# Altium schematic sheet USBPD_CH211.SchDoc
size A3; SheetNumber: 1; SheetTotal: 1
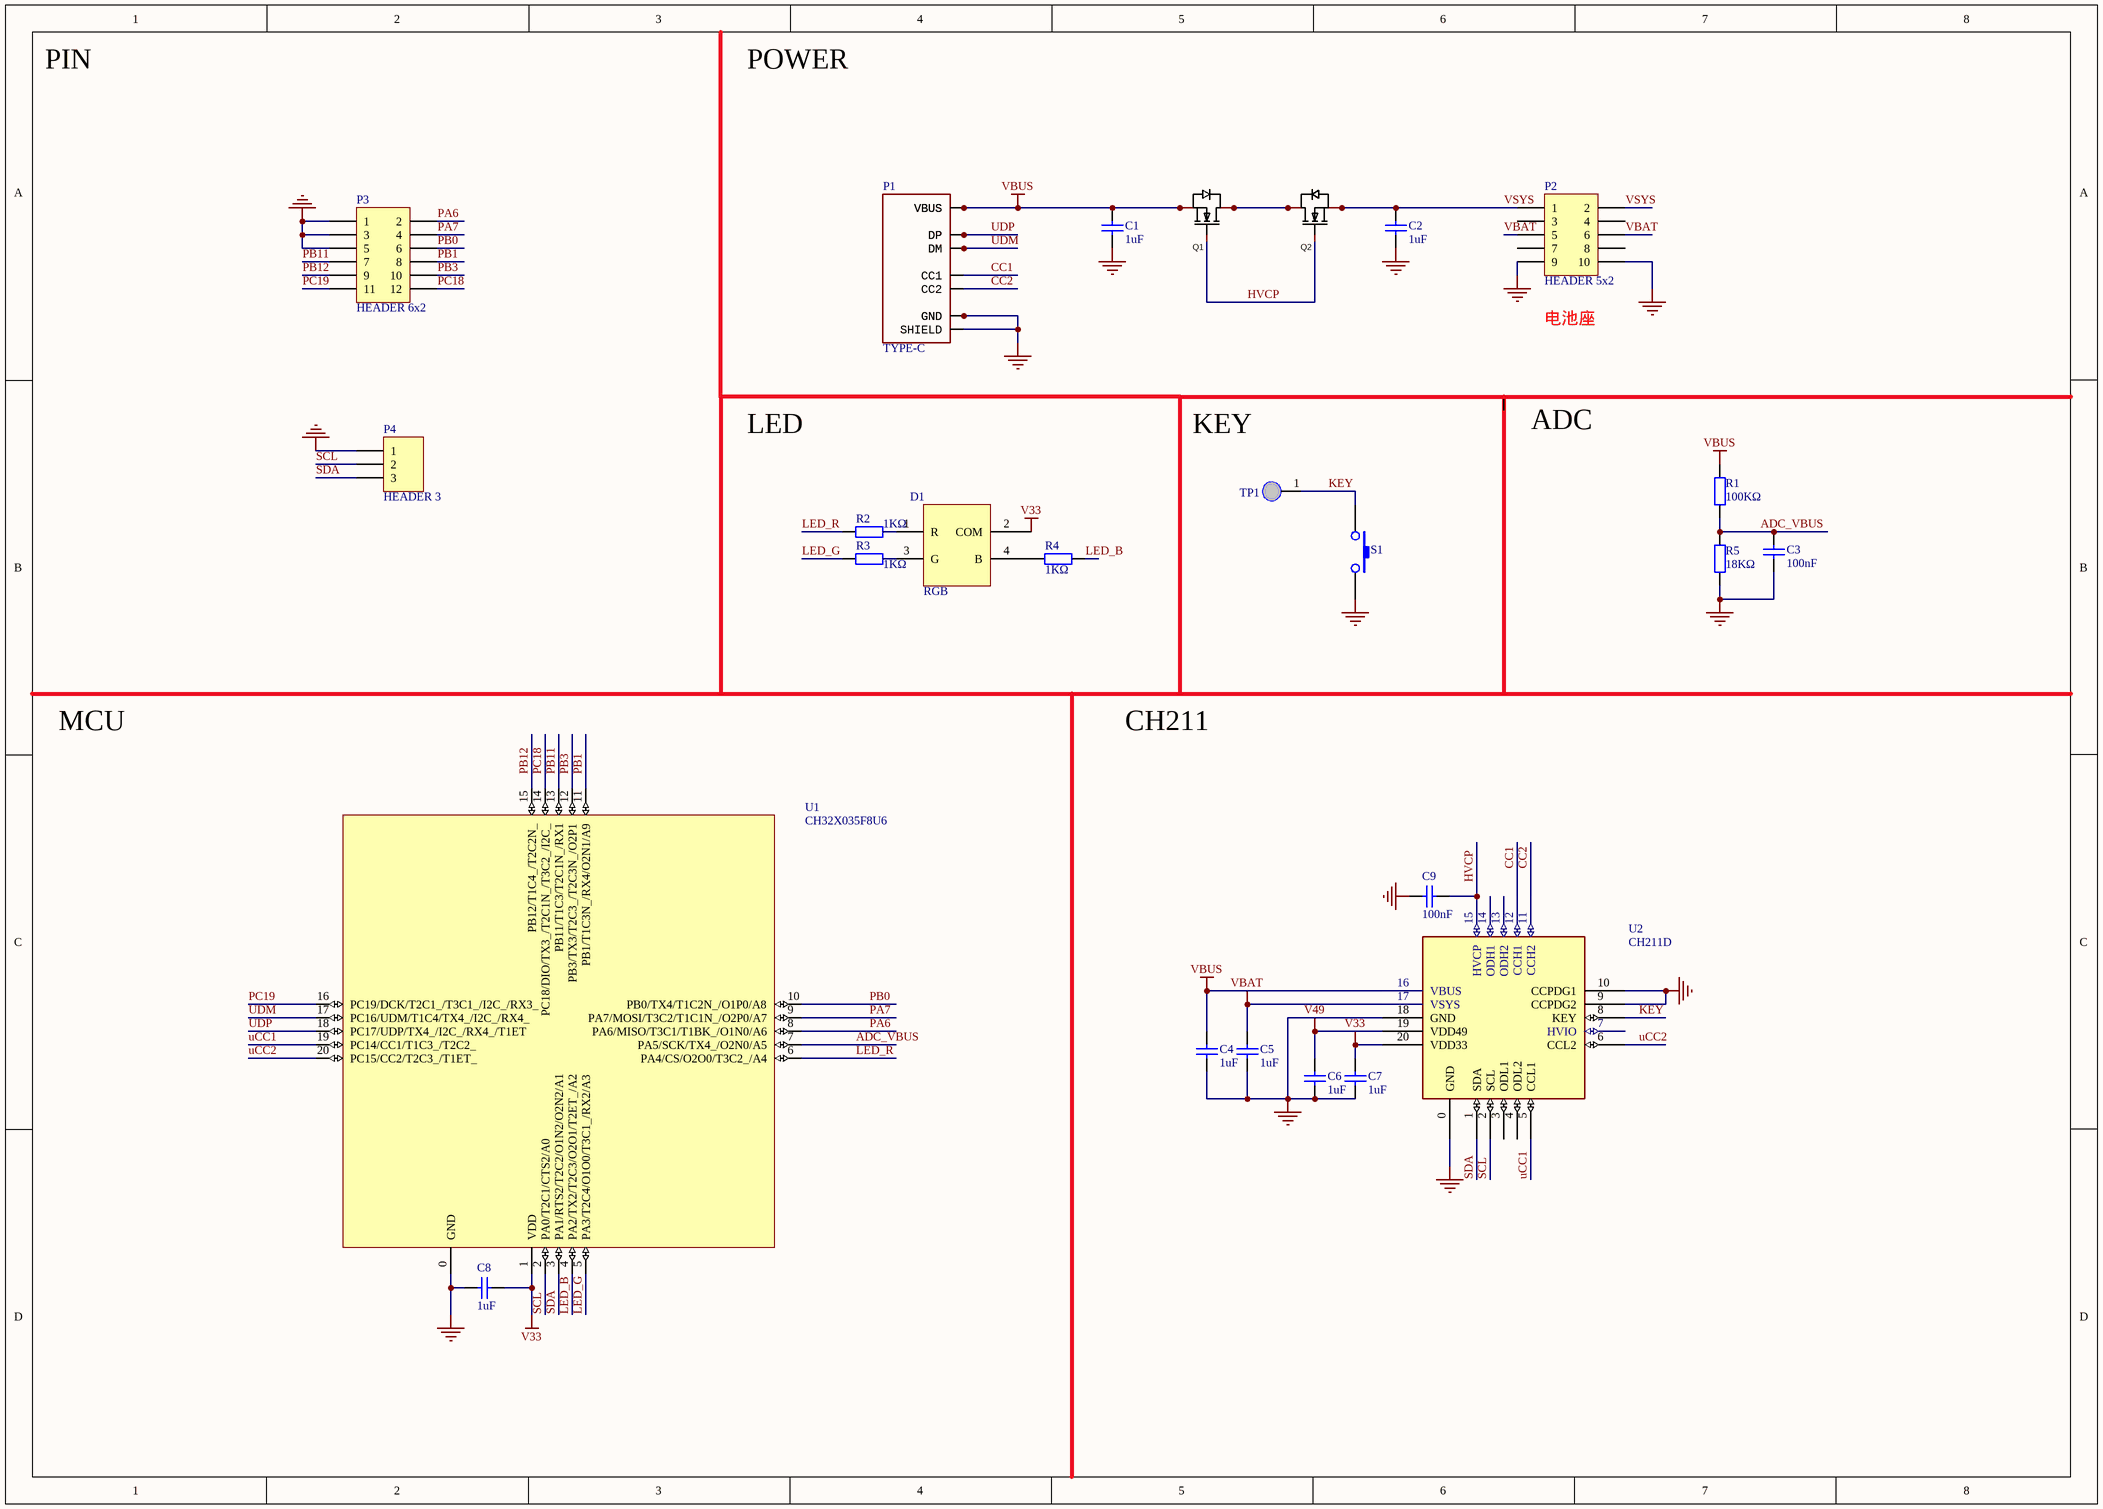
[diagram p0: USBPD_CH211.SchDoc]

## Parts
C1  1uF  [0603_C]
C2  1uF  [0603_C]
C3  100nF  [0603_C]
C4  1uF  [0603_C]
C5  1uF  [0603_C]
C6  1uF  [0603_C]
C7  1uF  [0603_C]
C8  1uF  [0603_C]
C9  100nF  [0603_C]
D1  RGB  [RGB 3030]
P1  TYPE-C  [TYPE-C-Receptacle-2.0]
P2  HEADER 5x2  [HDR2X5]
P3  HEADER 6x2  [HDR2X6]
P4  HEADER 3  [HDR1X3]
Q1  ASDM40N52E-R  [DFN-8_L3.1-W3.0-P0.65-LS3.3-BL]  (value not drawn)
Q2  ASDM40N52E-R  [DFN-8_L3.1-W3.0-P0.65-LS3.3-BL]  (value not drawn)
R1  100KΩ  [0603_R]
R2  1KΩ  [0603_R]
R3  1KΩ  [0603_R]
R4  1KΩ  [0603_R]
R5  18KΩ  [0603_R]
S1  KEY  [Button DTSZML-6]  (value not drawn)
TP1  Testpoint  [TESTPOINT3]  (value not drawn)
U1  CH32X035F8U6  [QFN20_3X3]
U2  CH211D  [QFN20_3X3]

## Nets
GND: C1.1 C2.1 C3.1 C4.1 C5.1 C6.1 C7.1 C8.2 C9.2 P1.0(SHIELD) P1.A1(GND) P1.A12(GND) P1.B1(GND) P1.B12(GND) P2.9 P2.10 P3.1 P3.3 P3.5 P4.1 R5.2 S1.2 U1.0(GND) U2.0(GND) U2.9(CCPDG2) U2.10(CCPDG1) U2.18(GND)
V33: C7.2 C8.1 D1.2(COM) U1.1(VDD) U2.20(VDD33)
V49: C6.2 U2.19(VDD49)
VBAT: C5.2 P2.5 P2.6 U2.17(VSYS)
VBUS: C1.2 C4.2 P1.A4(VBUS) P1.A9(VBUS) P1.B4(VBUS) P1.B9(VBUS) Q1.1(S) Q1.2(S) Q1.3(S) R1.1 U2.16(VBUS)
ADC_VBUS: C3.2 R1.2 R5.1 U1.7(PA5/SCK/TX4_/O2N0/A5)
CC1: P1.A5(CC1) U2.12(CCH1)
CC2: P1.B5(CC2) U2.11(CCH2)
HVCP: C9.1 Q1.4(G) Q2.4(G) U2.15(HVCP)
KEY: S1.3 TP1.1 U2.8(KEY)
LED_B: R4.2 U1.4(PA2/TX2/T2C3/O2O1/T2ET_/A2)
LED_G: R3.1 U1.5(PA3/T2C4/O1O0/T3C1_/RX2/A3)
LED_R: R2.1 U1.6(PA4/CS/O2O0/T3C2_/A4)
PA6: P3.2 U1.8(PA6/MISO/T3C1/T1BK_/O1N0/A6)
PA7: P3.4 U1.9(PA7/MOSI/T3C2/T1C1N_/O2P0/A7)
PB0: P3.6 U1.10(PB0/TX4/T1C2N_/O1P0/A8)
PB1: P3.8 U1.11(PB1/T1C3N_/RX4/O2N1/A9)
PB3: P3.10 U1.12(PB3/TX3/T2C3_/T2C3N_/O2P1)
PB11: P3.7 U1.13(PB11/T1C3/T2C1N_/RX1)
PB12: P3.9 U1.15(PB12/T1C4_/T2C2N_)
PC18: P3.12 U1.14(PC18/DIO/TX3_/T2C1N_/T3C2_/I2C_)
PC19: P3.11 U1.16(PC19/DCK/T2C1_/T3C1_/I2C_/RX3_)
SCL: P4.2 U1.2(PA0/T2C1/CTS2/A0) U2.2(SCL)
SDA: P4.3 U1.3(PA1/RTS2/T2C2/O1N2/O2N2/A1) U2.1(SDA)
uCC1: U1.19(PC14/CC1/T1C3_/T2C2_) U2.5(CCL1)
uCC2: U1.20(PC15/CC2/T2C3_/T1ET_) U2.6(CCL2)
UDM: P1.A7(DM) P1.B7(DM) U1.17(PC16/UDM/T1C4/TX4_/I2C_/RX4_)
UDP: P1.A6(DP) P1.B6(DP) U1.18(PC17/UDP/TX4_/I2C_/RX4_/T1ET)
VSYS: C2.2 P2.1 P2.2 Q2.1(S) Q2.2(S) Q2.3(S)
NetD1_1: D1.1(R) R2.2
NetD1_3: D1.3(G) R3.2
NetD1_4: D1.4(B) R4.1
NetQ1_5: Q1.5(D) Q1.6(D) Q1.7(D) Q1.8(D) Q2.5(D) Q2.6(D) Q2.7(D) Q2.8(D)

Not connected (* = marked no-connect by the designer): P2 3 4 7 8; U2 3(ODL1) 4(ODL2) 7(HVIO) 13(ODH2) 14(ODH1)

## Notes on the sheet
- PIN
- POWER
- (near P2) 电池座
- LED
- KEY
- ADC
- MCU
- CH211

## Library data of the parts
C1-C7 C9 = 0603 100nF (104) 10% 50V: 贴片电容; ComponentLink1Description: 供应商链接; ComponentLink1URL: http://www.szlcsc.com/product/details_15331.html; Package: 0603; Supplier: LC; SuppliersPartNumber: C14663
C8 = 0603 1uF (105) 10% 50V: 贴片电容; ComponentLink1Description: 供应商链接; ComponentLink1URL: http://www.szlcsc.com/product/details_16531.html; Package: 0603; Supplier: LC; SuppliersPartNumber: C15849
D1 = RGB: 共阳
P1 = TYPE-C-Receptacle-RefDesign
P2 = HEADER 5x2: Header, 5-Pin, Dual row
P3 = HEADER 6x2: Header, 6-Pin, Dual row
P4 = HEADER 3: Header, 3-Pin
Q1 Q2 = NMOS_DFN3*3.1: DFN_NMOS; Manufacturer: Ascend(安森德); Add into BOM: yes; Type: N沟道; Drain Source Voltage (Vdss): 40V; Continuous Drain Current (Id): 52A; Power Dissipation (Pd): 65W; Drain Source On Resistance (RDS(on)@Vgs,Id): 6.5mΩ@10V,20A; Gate Threshold Voltage (Vgs(th)@Id): 1.6V@250uA; Total Gate Charge (Qg@Vgs): 18nC@10V; Input Capacitance (Ciss@Vds): 980pF@20V; Reverse Transfer Capacitance (Crss@Vds): 80pF@20V; Name: ASDM40N52E-R; Symbol: ASDM40N52E; Device: ASDM40N52E-R; LCSC Part Name: N沟道 40V 52A; Supplier Part: C2758236; Manufacturer Part: ASDM40N52E-R; Supplier Footprint: DFN(3.3x3.3); JLCPCB Part Class: Extended Part; Datasheet: https://atta.szlcsc.com/upload/public/pdf/source/20210315/C2758236_ACA149CC0C7B2021969978014C40E8C1.pdf; Supplier: LCSC; Convert to PCB: yes; Operating Temperature: -55℃~+150℃@(Tj)
R1-R5 = 0603 100KΩ (1003) 1%: 贴片电阻; ComponentLink1Description: 供应商链接; ComponentLink1URL: http://www.szlcsc.com/product/details_26546.html; Package: 0603; Supplier: LC; SuppliersPartNumber: C25803
S1 = KEY1
TP1 = Testpoint: 测试点
U1 = CH32X035F8U6: RISC-V MCU with USB/PD/ADC/SPI/I2C/UART/OA
U2 = CH211D: 28V USB PD & Type-C high voltage interface